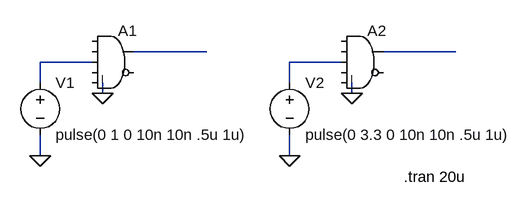
[diagram p0: schematic Gate1.asc]
Gate1.asc, the LTspice schematic file:
Version 4
SHEET 1 1220 680
WIRE 672 128 560 128
WIRE 1056 128 944 128
WIRE 496 144 416 144
WIRE 880 144 800 144
WIRE 416 176 416 144
WIRE 800 176 800 144
WIRE 512 192 512 176
WIRE 896 192 896 176
WIRE 416 288 416 256
WIRE 800 288 800 256
FLAG 416 288 0
FLAG 800 288 0
FLAG 512 192 0
FLAG 896 192 0
SYMBOL voltage 416 160 R0
SYMATTR InstName V1
SYMATTR Value pulse(0 1 0 10n 10n .5u 1u)
SYMBOL digital\\and 528 80 R0
SYMATTR InstName A1
SYMBOL voltage 800 160 R0
SYMATTR InstName V2
SYMATTR Value pulse(0 3.3 0 10n 10n .5u 1u)
SYMBOL digital\\and 912 80 R0
SYMATTR InstName A2
TEXT 976 320 Left 0 !.tran 20u

The netlist it stands for:
* Gate1.asc
V1 N003 0 pulse(0 1 0 10n 10n .5u 1u)
A1 0 0 N003 0 0 0 N001 0 AND
V2 N004 0 pulse(0 3.3 0 10n 10n .5u 1u)
A2 0 0 N004 0 0 0 N002 0 AND
.tran 20u
.backanno
.end